# EAGLE design LogicBoard (EAGLE 9.6.2)
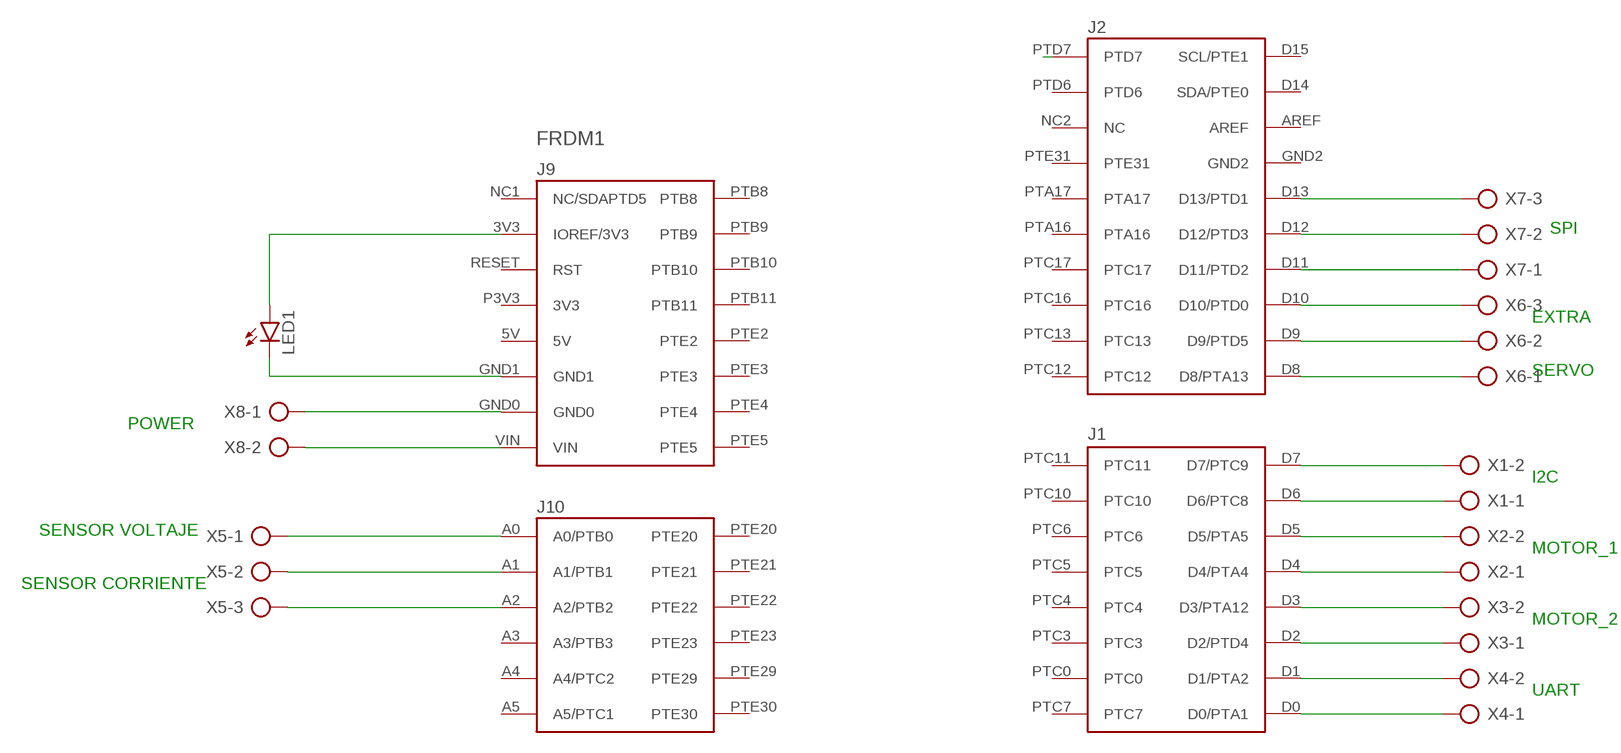
[diagram p0: schematic, sheet 1]

## Parts
FRDM1  FRDM-KL25ZNORMAL  [FRDM_KL25Z_NORMAL]
LED1  LED5MM  [LED5MM]
X1  AK500/2  [AK500/2]
X2  AK500/2  [AK500/2]
X3  AK500/2  [AK500/2]
X4  AK500/2  [AK500/2]
X5  AK500/3  [AK500/3]
X6  AK500/3  [AK500/3]
X7  AK500/3  [AK500/3]
X8  AK500/2  [AK500/2]

## Nets
N$1: FRDM1.D7(D7/PTC9) X1.2
N$2: FRDM1.D6(D6/PTC8) X1.1
N$3: FRDM1.D5(D5/PTA5) X2.2
N$4: FRDM1.D4(D4/PTA4) X2.1
N$5: FRDM1.D3(D3/PTA12) X3.2
N$6: FRDM1.D2(D2/PTD4) X3.1
N$7: FRDM1.D1(D1/PTA2) X4.2
N$8: FRDM1.D0(D0/PTA1) X4.1
N$9: FRDM1.GND0 X8.1
N$10: FRDM1.VIN X8.2
N$11: FRDM1.A0(A0/PTB0) X5.1
N$12: FRDM1.A1(A1/PTB1) X5.2
N$13: FRDM1.A2(A2/PTB2) X5.3
N$14: FRDM1.D8(D8/PTA13) X6.1
N$15: FRDM1.D9(D9/PTD5) X6.2
N$16: FRDM1.D10(D10/PTD0) X6.3
N$17: FRDM1.D11(D11/PTD2) X7.1
N$18: FRDM1.D12(D12/PTD3) X7.2
N$19: FRDM1.D13(D13/PTD1) X7.3
N$20: FRDM1.PTD7
N$21: FRDM1.GND1 LED1.K(C)
N$22: FRDM1.3V3(IOREF/3V3) LED1.A
Unconnected: FRDM1.5V FRDM1.A3(A3/PTB3) FRDM1.A4(A4/PTC2) FRDM1.A5(A5/PTC1) FRDM1.AREF FRDM1.D14(SDA/PTE0) FRDM1.D15(SCL/PTE1) FRDM1.GND2 FRDM1.NC1(NC/SDAPTD5) FRDM1.NC2(NC) FRDM1.P3V3(3V3) FRDM1.PTA16 FRDM1.PTA17 FRDM1.PTB8 FRDM1.PTB9 FRDM1.PTB10 FRDM1.PTB11 FRDM1.PTC0 FRDM1.PTC3 FRDM1.PTC4 FRDM1.PTC5 FRDM1.PTC6 FRDM1.PTC7 FRDM1.PTC10 FRDM1.PTC11 FRDM1.PTC12 FRDM1.PTC13 FRDM1.PTC16 FRDM1.PTC17 FRDM1.PTD6 FRDM1.PTE2 FRDM1.PTE3 FRDM1.PTE4 FRDM1.PTE5 FRDM1.PTE20 FRDM1.PTE21 FRDM1.PTE22 FRDM1.PTE23 FRDM1.PTE29 FRDM1.PTE30 FRDM1.PTE31 FRDM1.RESET(RST)

## Notes on the sheet
- SPI
- EXTRA
- SERVO
- POWER
- I2C
- SENSOR VOLTAJE
- MOTOR_1
- SENSOR CORRIENTE
- MOTOR_2
- UART

## Library data of the parts
FRDM1 = FRDM-KL25Z:FRDM-KL25Z: For creating FRDM-KL25Z shields Check availability <https://pricing.snapeda.com/parts/FRDM-KL25Z/NXP%20USA/view-part?ref=eda>; AVAILABILITY: In Stock; DESCRIPTION: KL1x, KL2x, mbed-Enabled Development Freedom Kinetis ARM® Cortex®-M0+ MCU 32-Bit Embedded Evaluation Board; MF: NXP USA; MP: FRDM-KL25Z; PACKAGE: None; PRICE: None; PURCHASE-URL: https://pricing.snapeda.com/search/part/FRDM-KL25Z/?ref=eda
LED1 = led:LED: LED OSRAM: - CHIPLED LG R971, LG N971, LY N971, LG Q971, LY Q971, LO R971, LY R971 LH N974, LH R974 LS Q976, LO Q976, LY Q976 LO Q996 - Hyper CHIPLED LW Q18S LB Q993, LB Q99A, LB R99A - SideLED LS A670, LO A670, LY A670, LG A670, LP A670 LB A673, LV A673, LT A673, LW A673 LH A674 LY A675 LS A676, LA A676, LO A676, LY A676, LW A676 LS A679, LY A679, LG A679 - Hyper Micro SIDELED® LS Y876, LA Y876, LO Y876, LY Y876 LT Y87S - SmartLED LW L88C, LW L88S LB L89C, LB L89S, LG L890 LS L89K, LO L89K, LY L89K LS L896, LA L896, LO L896, LY L896 - TOPLED LS T670, LO T670, LY T670, LG T670, LP T670 LSG T670, LSP T670, LSY T670, LOP T670, LYG T670 LG T671, LOG T671, LSG T671 LB T673, LV T673, LT T673, LW T673 LH T674 LS T676, LA T676, LO T676, LY T676, LB T676, LH T676, LSB T676, LW T676 LB T67C, LV T67C, LT T67C, LS T67K, LO T67K, LY T67K, LW E67C LS E67B, LA E67B, LO E67B, LY E67B, LB E67C, LV E67C, LT E67C LW T67C LS T679, LY T679, LG T679 LS T770, LO T770, LY T770, LG T770, LP T770 LB T773, LV T773, LT T773, LW T773 LH T774 LS E675, LA E675, LY E675, LS T675 LS T776, LA T776, LO T776, LY T776, LB T776 LHGB T686 LT T68C, LB T68C - Hyper Mini TOPLED® LB M676 - Mini TOPLED Santana® LG M470 LS M47K, LO M47K, LY M47K Source: http://www.osram.convergy.de LUXEON: - LUMILED® LXK2-PW12-R00, LXK2-PW12-S00, LXK2-PW14-U00, LXK2-PW14-V00 LXK2-PM12-R00, LXK2-PM12-S00, LXK2-PM14-U00 LXK2-PE12-Q00, LXK2-PE12-R00, LXK2-PE12-S00, LXK2-PE14-T00, LXK2-PE14-U00 LXK2-PB12-K00, LXK2-PB12-L00, LXK2-PB12-M00, LXK2-PB14-N00, LXK2-PB14-P00, LXK2-PB14-Q00 LXK2-PR12-L00, LXK2-PR12-M00, LXK2-PR14-Q00, LXK2-PR14-R00 LXK2-PD12-Q00, LXK2-PD12-R00, LXK2-PD12-S00 LXK2-PH12-R00, LXK2-PH12-S00 LXK2-PL12-P00, LXK2-PL12-Q00, LXK2-PL12-R00 Source: www.luxeon.com KINGBRIGHT: KA-3528ASYC Source: www.kingbright.com
X1-X4 X8 = con-ptr500:AK500/2: CONNECTOR; OC_FARNELL: unknown; OC_NEWARK: unknown
X5-X7 = con-ptr500:AK500/3: CONNECTOR; OC_FARNELL: unknown; OC_NEWARK: unknown

## Board
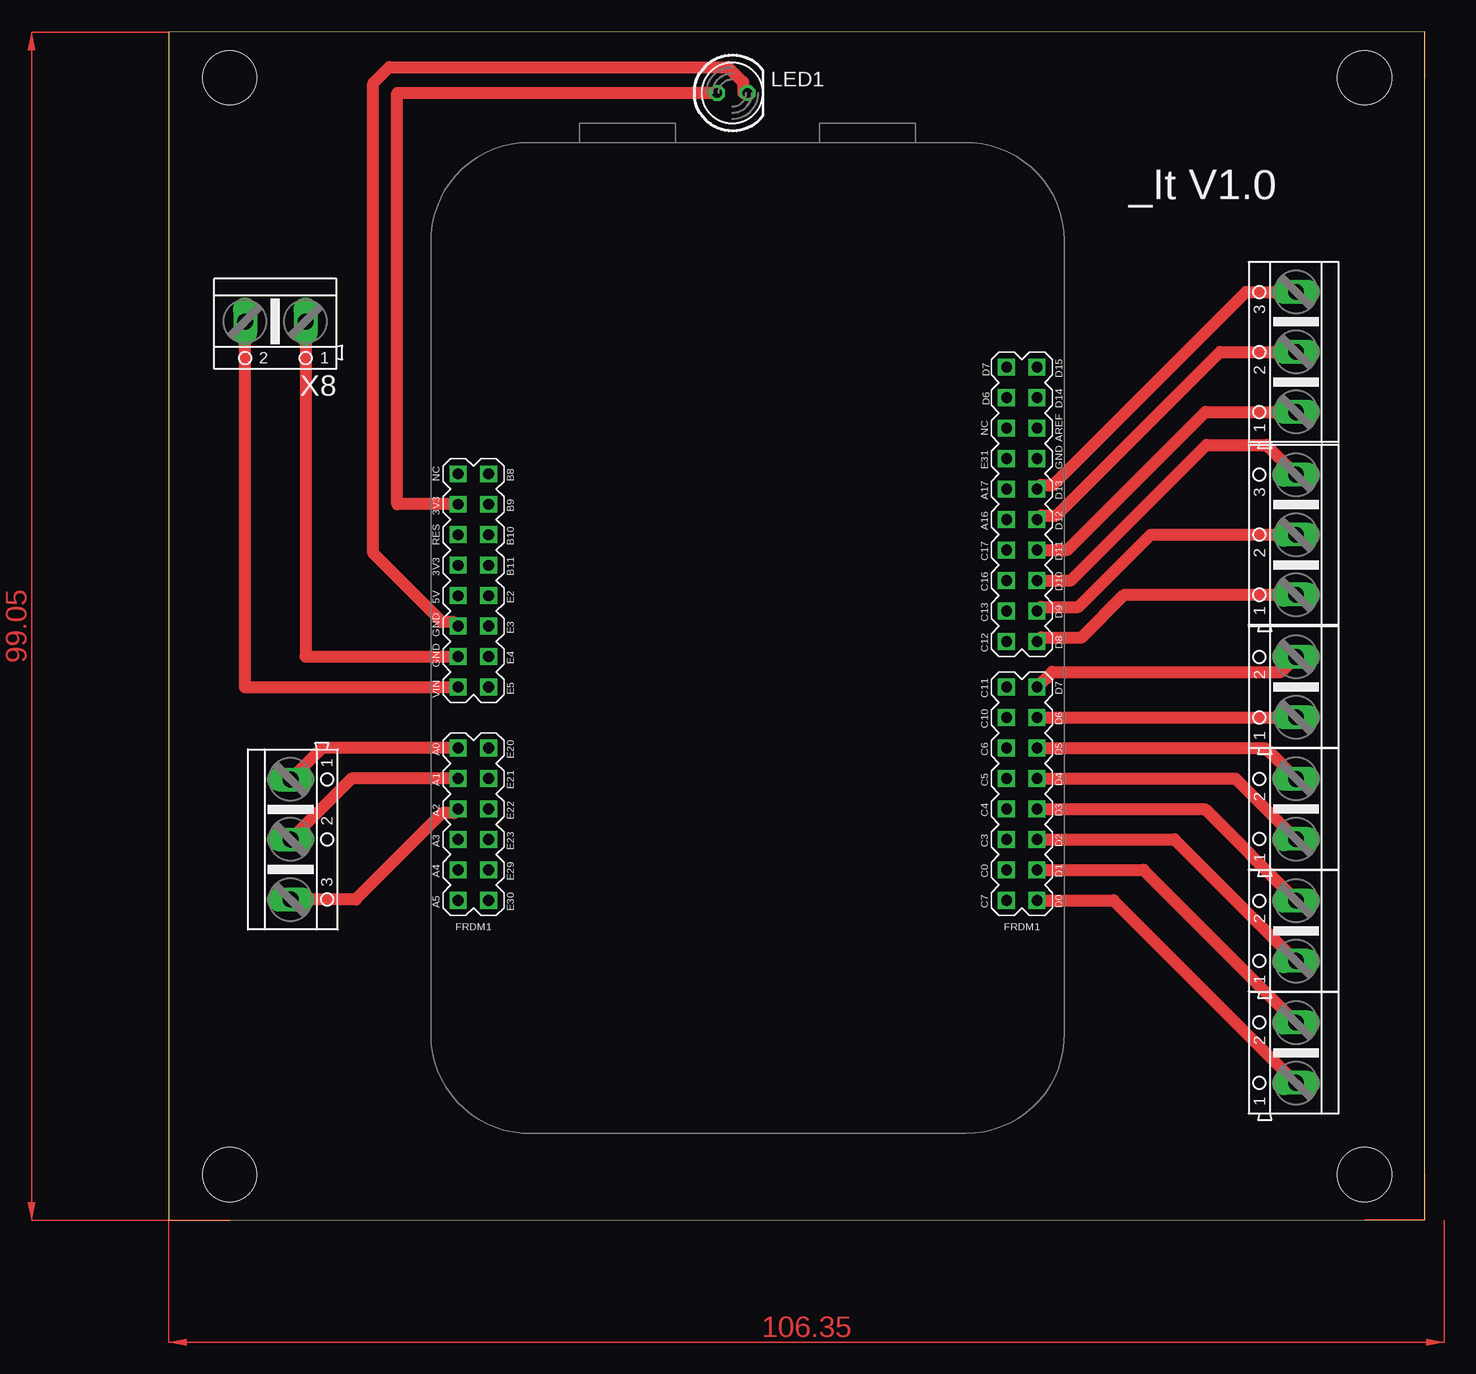
[diagram p1: board, top side]

Size 104.7 x 99.1 mm. Coordinates in mm from the lower left corner, seen from the top.
Outline: 0,0 104.7,0.05 104.7,99.1 0,99.05 0,0
Copper layers (1*16): Top 0.035mm / dielectric 1.5mm / Bottom 0.035mm
Design rules "default *": minimum track width 1mm, minimum drill 0.35mm, track to track 1mm, track to pad 1mm, pad to pad 6mil, via to via 6mil, smd to smd 6mil, copper to edge 40mil, drill to drill 6mil, minimum pad ring 10mil, minimum via ring 8mil, stop-mask expansion 4mil, vias tented up to drill 0mil, thermal gap 10mil
Holes 4.5 mm at 5.08,3.81 5.08,95.25 99.69,95.25 99.69,3.81

### Footprints (pad centres in the part's own frame; a part is rotated, then mirrored left to right if it is on the bottom)
FRDM_KL25Z_NORMAL = drill 0.9 square: 3V3 24.13,-15.24; 5V 24.13,-7.62; A0 24.13,5.08; A1 24.13,7.62; A2 24.13,10.16; A3 24.13,12.7; A4 24.13,15.24; A5 24.13,17.78; AREF -24.13,-21.59; D0 -24.13,17.78; D1 -24.13,15.24; D2 -24.13,12.7; D3 -24.13,10.16; D4 -24.13,7.62; D5 -24.13,5.08; D6 -24.13,2.54; D7 -24.13,0; D8 -24.13,-3.81; D9 -24.13,-6.35; D10 -24.13,-8.89; D11 -24.13,-11.43; D12 -24.13,-13.97; D13 -24.13,-16.51; D14 -24.13,-24.13; D15 -24.13,-26.67; GND0 24.13,-2.54; GND1 24.13,-5.08; GND2 -24.13,-19.05; NC1 24.13,-17.78; NC2 -21.59,-21.59; P3V3 24.13,-10.16; PTA16 -21.59,-13.97; PTA17 -21.59,-16.51; PTB8 21.59,-17.78; PTB9 21.59,-15.24; PTB10 21.59,-12.7; PTB11 21.59,-10.16; PTC0 -21.59,15.24; PTC3 -21.59,12.7; PTC4 -21.59,10.16; PTC5 -21.59,7.62; PTC6 -21.59,5.08; PTC7 -21.59,17.78; PTC10 -21.59,2.54; PTC11 -21.59,0; PTC12 -21.59,-3.81; PTC13 -21.59,-6.35; PTC16 -21.59,-8.89; PTC17 -21.59,-11.43; PTD6 -21.59,-24.13; PTD7 -21.59,-26.67; PTE2 21.59,-7.62; PTE3 21.59,-5.08; PTE4 21.59,-2.54; PTE5 21.59,0; PTE20 21.59,5.08; PTE21 21.59,7.62; PTE22 21.59,10.16; PTE23 21.59,12.7; PTE29 21.59,15.24; PTE30 21.59,17.78; PTE31 -21.59,-19.05; RESET 24.13,-12.7; VIN 24.13,0
LED5MM = drill 0.813 octagon: A -1.27,0; K 1.27,0
AK500/2 = drill 1.321 long: 1 -2.515,0; 2 2.515,0
AK500/3 = drill 1.321 long: 1 -5.004,0; 2 0,0; 3 5.004,0

### Placement (x,y rotation side)
FRDM1  48.26,44.45 180 top
LED1  46.99,93.98 0 top
X1  93.98,44.45 90 top
X2  93.98,34.29 90 top
X3  93.98,24.13 90 top
X4  93.98,13.97 90 top
X5  10.16,31.75 270 top
X6  93.98,57.15 90 top
X7  93.98,72.39 90 top
X8  8.89,74.93 180 top

### Tracks (layer width: path | path; a pad name or v marks a point on that pad's centre or on a via)
N$1
  Top 1: FRDM1.D7 73.66,45.72 92.73,45.72 X1.2
N$2  (1 unrouted)
  Top 1: FRDM1.D6 93.98,41.91
N$3
  Top 1: FRDM1.D5 91.42,39.37 X2.2
N$4
  Top 1: FRDM1.D4 88.92,36.83 X2.1
N$5  (1 unrouted)
  Top 1: FRDM1.D3 86.36,34.29 93.98,26.67
N$6
  Top 1: FRDM1.D2 83.84,31.75 X3.1
N$7
  Top 1: FRDM1.D1 81.25,29.21 X4.2
N$8
  Top 1: FRDM1.D0 78.77,26.67 X4.1
N$9
  Top 1: X8.1 11.4,47.02 11.43,46.99 FRDM1.GND0
N$10
  Top 1: FRDM1.VIN 6.35,44.45 6.35,74.91 X8.2
N$11
  Top 1: FRDM1.A0 12.78,39.37 X5.1
N$12
  Top 1: X5.2 15.24,36.83 FRDM1.A1
N$13
  Top 1: FRDM1.A2 23.79,33.95 22.8,33.95 15.6,26.75 X5.3
N$14
  Top 1: FRDM1.D8 72.73,48.6 76.13,48.6 79.68,52.15 X6.1
N$15
  Top 1: FRDM1.D9 72.73,51.14 75.84,51.14 81.86,57.15 X6.2
N$16
  Top 1: FRDM1.D10 75.22,53.34 86.5,64.63 91.51,64.63 X6.3
N$17
  Top 1: FRDM1.D11 74.93,55.88 86.44,67.39 X7.1
N$18
  Top 1: FRDM1.D12 72.73,58.76 74,58.76 87.64,72.39 X7.2
N$19
  Top 1: FRDM1.D13 72.73,61.3 73.72,61.3 89.81,77.39 X7.3
N$21
  Top 1: FRDM1.GND1 23.79,49.87 22.8,49.87 17.05,55.62 17.05,94.81 18.38,96.14 46.62,96.14 47.88,94.88 47.88,93.98 LED1.K
N$22
  Top 1: FRDM1.3V3 19.05,59.69 19.05,93.98 LED1.A
(copper drawn outside any net)
  shapes: Top area x7

### Text on the board
tPlace: _It V1.0